# EAGLE design Negative_Ioniser (EAGLE 9.5.1)
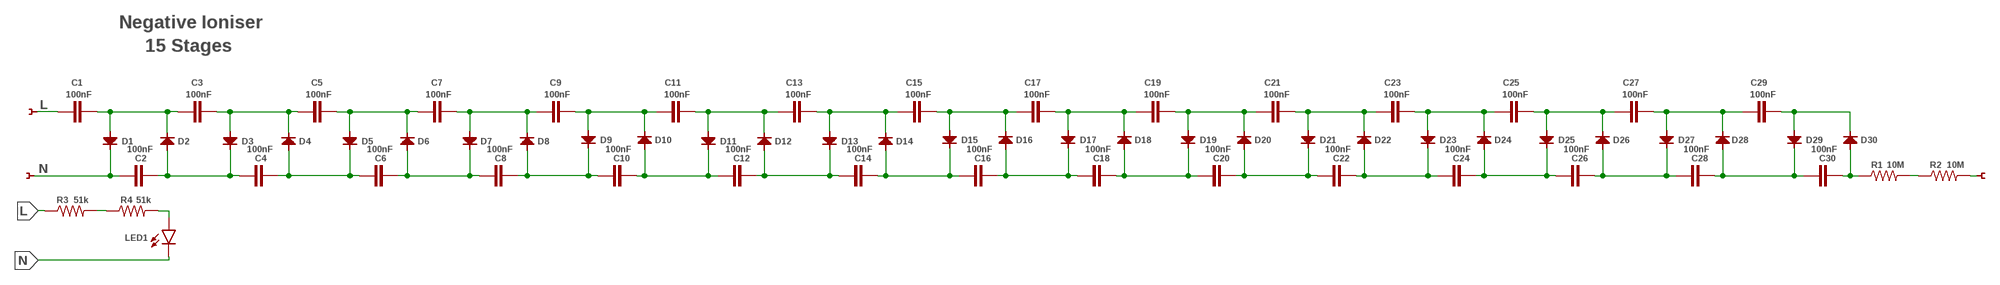
[diagram p0: schematic, sheet 1]

## Parts
C1  100nF  CAPACITOR-1812  [C1812]
C2  100nF  CAPACITOR-1812  [C1812]
C3  100nF  CAPACITOR-1812  [C1812]
C4  100nF  CAPACITOR-1812  [C1812]
C5  100nF  CAPACITOR-1812  [C1812]
C6  100nF  CAPACITOR-1812  [C1812]
C7  100nF  CAPACITOR-1812  [C1812]
C8  100nF  CAPACITOR-1812  [C1812]
C9  100nF  CAPACITOR-1812  [C1812]
C10  100nF  CAPACITOR-1812  [C1812]
C11  100nF  CAPACITOR-1812  [C1812]
C12  100nF  CAPACITOR-1812  [C1812]
C13  100nF  CAPACITOR-1812  [C1812]
C14  100nF  CAPACITOR-1812  [C1812]
C15  100nF  CAPACITOR-1812  [C1812]
C16  100nF  CAPACITOR-1812  [C1812]
C17  100nF  CAPACITOR-1812  [C1812]
C18  100nF  CAPACITOR-1812  [C1812]
C19  100nF  CAPACITOR-1812  [C1812]
C20  100nF  CAPACITOR-1812  [C1812]
C21  100nF  CAPACITOR-1812  [C1812]
C22  100nF  CAPACITOR-1812  [C1812]
C23  100nF  CAPACITOR-1812  [C1812]
C24  100nF  CAPACITOR-1812  [C1812]
C25  100nF  CAPACITOR-1812  [C1812]
C26  100nF  CAPACITOR-1812  [C1812]
C27  100nF  CAPACITOR-1812  [C1812]
C28  100nF  CAPACITOR-1812  [C1812]
C29  100nF  CAPACITOR-1812  [C1812]
C30  100nF  CAPACITOR-1812  [C1812]
D1  DIODE-1N4007  [DO-214A]
D2  DIODE-1N4007  [DO-214A]
D3  DIODE-1N4007  [DO-214A]
D4  DIODE-1N4007  [DO-214A]
D5  DIODE-1N4007  [DO-214A]
D6  DIODE-1N4007  [DO-214A]
D7  DIODE-1N4007  [DO-214A]
D8  DIODE-1N4007  [DO-214A]
D9  DIODE-1N4007  [DO-214A]
D10  DIODE-1N4007  [DO-214A]
D11  DIODE-1N4007  [DO-214A]
D12  DIODE-1N4007  [DO-214A]
D13  DIODE-1N4007  [DO-214A]
D14  DIODE-1N4007  [DO-214A]
D15  DIODE-1N4007  [DO-214A]
D16  DIODE-1N4007  [DO-214A]
D17  DIODE-1N4007  [DO-214A]
D18  DIODE-1N4007  [DO-214A]
D19  DIODE-1N4007  [DO-214A]
D20  DIODE-1N4007  [DO-214A]
D21  DIODE-1N4007  [DO-214A]
D22  DIODE-1N4007  [DO-214A]
D23  DIODE-1N4007  [DO-214A]
D24  DIODE-1N4007  [DO-214A]
D25  DIODE-1N4007  [DO-214A]
D26  DIODE-1N4007  [DO-214A]
D27  DIODE-1N4007  [DO-214A]
D28  DIODE-1N4007  [DO-214A]
D29  DIODE-1N4007  [DO-214A]
D30  DIODE-1N4007  [DO-214A]
LED1  LED-0603-SMD  [LED-0603]
R1  10M  RESISTOR-1206  [R1206]
R2  10M  RESISTOR-1206  [R1206]
R3  51k  RESISTOR-1210  [R1210]
R4  51k  RESISTOR-1210  [R1210]
TP1  TEST-POINT5MM  [SMD-SQ-PADS-5MM]
TP2  TEST-POINT5MM  [SMD-SQ-PADS-5MM]
TP3  TEST-POINT30X10  [LONG-RECT-PAD-50MM]

## Nets
L: C1.1 R3.1 TP1.P$1
N: C2.1 D1.CATHODE(C) LED1.C TP2.P$1
N$1: C2.2 C4.1 D2.ANODE(A) D3.CATHODE(C)
N$2: C1.2 C3.1 D1.ANODE(A) D2.CATHODE(C)
N$3: R3.2 R4.1
N$5: R1.2 R2.1
N$9: C5.2 C7.1 D5.ANODE(A) D6.CATHODE(C)
N$10: C4.2 C6.1 D4.ANODE(A) D5.CATHODE(C)
N$11: LED1.A R4.2
N$12: C6.2 C8.1 D6.ANODE(A) D7.CATHODE(C)
N$16: C3.2 C5.1 D3.ANODE(A) D4.CATHODE(C)
N$17: C9.2 C11.1 D9.ANODE(A) D10.CATHODE(C)
N$18: C8.2 C10.1 D8.ANODE(A) D9.CATHODE(C)
N$19: C10.2 C12.1 D10.ANODE(A) D11.CATHODE(C)
N$22: C7.2 C9.1 D7.ANODE(A) D8.CATHODE(C)
N$23: C13.2 C15.1 D13.ANODE(A) D14.CATHODE(C)
N$24: C12.2 C14.1 D12.ANODE(A) D13.CATHODE(C)
N$25: C14.2 C16.1 D14.ANODE(A) D15.CATHODE(C)
N$28: C11.2 C13.1 D11.ANODE(A) D12.CATHODE(C)
N$29: C17.2 C19.1 D17.ANODE(A) D18.CATHODE(C)
N$30: C16.2 C18.1 D16.ANODE(A) D17.CATHODE(C)
N$31: C18.2 C20.1 D18.ANODE(A) D19.CATHODE(C)
N$34: C15.2 C17.1 D15.ANODE(A) D16.CATHODE(C)
N$35: C21.2 C23.1 D21.ANODE(A) D22.CATHODE(C)
N$36: C20.2 C22.1 D20.ANODE(A) D21.CATHODE(C)
N$37: C22.2 C24.1 D22.ANODE(A) D23.CATHODE(C)
N$40: C19.2 C21.1 D19.ANODE(A) D20.CATHODE(C)
N$41: C25.2 C27.1 D25.ANODE(A) D26.CATHODE(C)
N$42: C24.2 C26.1 D24.ANODE(A) D25.CATHODE(C)
N$43: C26.2 C28.1 D26.ANODE(A) D27.CATHODE(C)
N$46: C23.2 C25.1 D23.ANODE(A) D24.CATHODE(C)
N$47: C27.2 C29.1 D27.ANODE(A) D28.CATHODE(C)
N$48: C28.2 C30.1 D28.ANODE(A) D29.CATHODE(C)
N$49: C29.2 D29.ANODE(A) D30.CATHODE(C)
N$50: C30.2 D30.ANODE(A) R1.1
OUTPUT: R2.2 TP3.1

## Notes on the sheet
- Negative Ioniser
- 15 Stages
- L
- N

## Library data of the parts
C1-C30 = Amaldev:CAPACITOR; PART-NUM: 1812B104K631CT; RATED: 630V; TOLERANCE: ±10%
D1-D30 = Amaldev:DIODE; I-RATING: 1A; PART-NUM: 1N4007G; V-RATING: 1kV
LED1 = Amaldev:LED; PART-NUM: D-060306R1/SS2/L
R1 R2 = Amaldev:RESISTOR; PART-NUM: 1206W4F1005T5E; RATED: 0.25W; TOLERANCE: ±1%
R3 R4 = Amaldev:RESISTOR; PART-NUM: CR1210J51K0P05Z; RATED: 0.5W; TOLERANCE: ±5%
TP1-TP3 = Amaldev:TEST-POINT

## Board
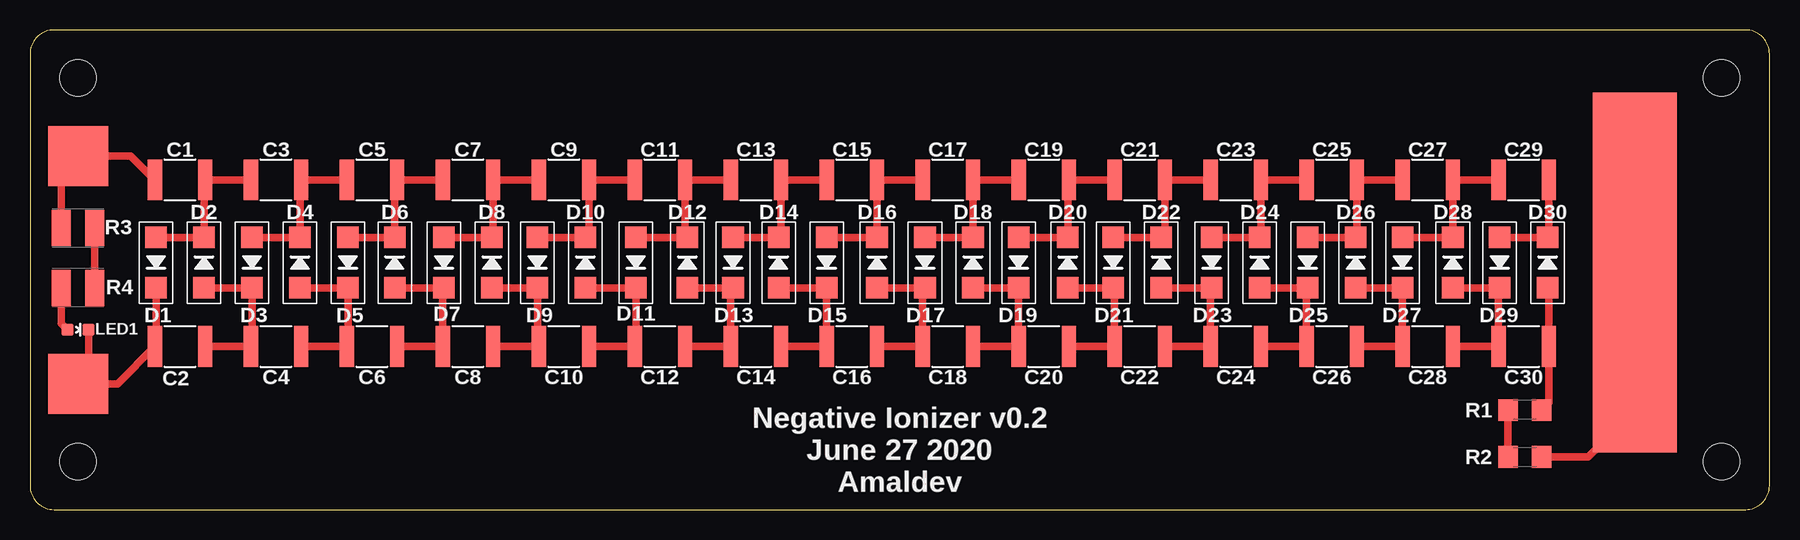
[diagram p1: board, top side]

Size 145 x 40 mm. Coordinates in mm from the lower left corner, seen from the top.
Outline: 2,0 143,0 arc90 145,2 145,38 arc90 143,40 2,40 arc90 0,38 0,2 arc90 2,0
Copper layers (1*16): Top 0.035mm / dielectric 1.5mm / Bottom 0.035mm
Design rules "PCB-Power-Design-Guidelines": minimum track width 6mil, minimum drill 10mil, track to track 6mil, track to pad 6mil, pad to pad 6mil, via to via 6mil, smd to smd 6mil, copper to edge 20mil, drill to drill 8mil, minimum pad ring 10mil, minimum via ring 8mil, stop-mask expansion 4mil, vias tented up to drill 0mil, thermal gap 10mil
Holes 3 mm at 4,4 4,36 141,36 141,4

### Footprints (pad centres in the part's own frame; a part is rotated, then mirrored left to right if it is on the bottom)
C1812 = smd 1.2 x 3.4: 1 -2.1,0; 2 2.1,0
DO-214A = smd 1.8 x 1.8: ANODE -2.1,0; CATHODE 2.1,0
LED-0603 = smd 1 x 1: A 0,-0.877; C 0,0.877
R1206 = smd 1.6 x 1.8: 1 -1.4,0; 2 1.4,0
R1210 = smd 1.6 x 3: 1 -1.4,0; 2 1.4,0
SMD-SQ-PADS-5MM = smd 5 x 5: P$1 0,0
LONG-RECT-PAD-50MM = smd 30 x 7: 1 0,0

### Placement (x,y rotation side)
C1  12.5,27.5 0 top
C2  12.5,13.6 0 top
C3  20.5,27.5 0 top
C4  20.5,13.6 0 top
C5  28.5,27.5 0 top
C6  28.5,13.6 0 top
C7  36.5,27.5 0 top
C8  36.5,13.6 0 top
C9  44.5,27.5 0 top
C10  44.5,13.6 0 top
C11  52.5,27.5 0 top
C12  52.5,13.6 0 top
C13  60.5,27.5 0 top
C14  60.5,13.6 0 top
C15  68.5,27.5 0 top
C16  68.5,13.6 0 top
C17  76.5,27.5 0 top
C18  76.5,13.6 0 top
C19  84.5,27.5 0 top
C20  84.5,13.6 0 top
C21  92.5,27.5 0 top
C22  92.5,13.6 0 top
C23  100.5,27.5 0 top
C24  100.5,13.6 0 top
C25  108.5,27.5 0 top
C26  108.5,13.6 0 top
C27  116.5,27.5 0 top
C28  116.5,13.6 0 top
C29  124.5,27.5 0 top
C30  124.5,13.6 0 top
D1  10.5,20.6 270 top
D2  14.5,20.6 90 top
D3  18.5,20.6 270 top
D4  22.5,20.6 90 top
D5  26.5,20.6 270 top
D6  30.4,20.6 90 top
D7  34.5,20.6 270 top
D8  38.5,20.6 90 top
D9  42.3,20.6 270 top
D10  46.3,20.6 90 top
D11  50.5,20.6 270 top
D12  54.8,20.6 90 top
D13  58.6,20.6 270 top
D14  62.4,20.6 90 top
D15  66.4,20.6 270 top
D16  70.6,20.6 90 top
D17  74.6,20.6 270 top
D18  78.6,20.6 90 top
D19  82.4,20.6 270 top
D20  86.5,20.6 90 top
D21  90.3,20.6 270 top
D22  94.3,20.6 90 top
D23  98.5,20.6 270 top
D24  102.5,20.6 90 top
D25  106.5,20.6 270 top
D26  110.5,20.6 90 top
D27  114.4,20.6 270 top
D28  118.6,20.6 90 top
D29  122.5,20.6 270 top
D30  126.5,20.6 90 top
LED1  4,15 270 top
R1  124.6,8.3 180 top
R2  124.6,4.4 0 top
R3  4,23.5 0 top
R4  4,18.5 180 top
TP1  4,29.5 0 top
TP2  4,10.5 0 top
TP3  133.79,19.79 90 top

### Tracks (layer width: path | path; a pad name or v marks a point on that pad's centre or on a via)
L
  Top 0.61: C1.1 8.4,29.5 TP1.P$1 4,28.5 2.6,27.1 R3.1
N
  Top 0.61: D1.CATHODE 10.5,14.7 10.4,14.6 C2.1 7.3,10.5 TP2.P$1 4.88,11.38 LED1.C
N$1
  Top 0.61: C2.2 C4.1 18.5,13.7 D3.CATHODE D2.ANODE
N$2
  Top 0.61: C3.1 C1.2 14.5,27.4 D2.CATHODE D1.ANODE
N$3
  Top 0.61: R4.1 R3.2
N$5
  Top 0.61: R1.2 R2.1
N$9
  Top 0.61: 30.8,27.5 C5.2 30.5,27.4 | 30.8,27.5 C7.1 | D5.ANODE D6.CATHODE 30.4,27.1 30.8,27.5
N$10
  Top 0.61: C4.2 C6.1 26.5,13.7 D5.CATHODE D4.ANODE
N$11
  Top 0.61: R4.2 2.6,15.52 LED1.A
N$12
  Top 0.61: C6.2 C8.1 34.4,18.4 D7.CATHODE D6.ANODE
N$16
  Top 0.61: C3.2 22.7,27.5 | 22.7,27.5 C5.1 | 22.7,27.5 22.5,27.3 22.6,27.2 22.6,26.2 22.5,26.1 D4.CATHODE D3.ANODE
N$17
  Top 0.61: C11.1 C9.2 46.6,23 D10.CATHODE D9.ANODE
N$18
  Top 0.61: 42.4,13.1 42.5,13 42.5,13.6 C8.2 | 42.4,13.1 C10.1 | D8.ANODE D9.CATHODE 42.3,13.2 42.4,13.1
N$19
  Top 0.61: C10.2 C12.1 50.5,13.7 D11.CATHODE D10.ANODE
N$22
  Top 0.61: C9.1 C7.2 | C7.2 38.5,27.4 | D7.ANODE D8.CATHODE 38.6,22.8 C7.2
N$23
  Top 0.61: C15.1 C13.2 62.6,22.9 D14.CATHODE D13.ANODE
N$24
  Top 0.61: C12.2 C14.1 58.4,18.3 D13.CATHODE D12.ANODE
N$25
  Top 0.61: C14.2 C16.1 D15.CATHODE D14.ANODE
N$28
  Top 0.61: C11.2 C13.1 | 54.5,27.4 C11.2 | D11.ANODE D12.CATHODE 54.6,22.9 C11.2
N$29
  Top 0.61: C19.1 C17.2 78.6,22.8 78.5,22.7 | 79.1,22.6 79,22.7 D18.CATHODE 78.5,22.7 | D17.ANODE 78.5,22.7
N$30
  Top 0.61: C16.2 C18.1 74.4,18.3 D17.CATHODE D16.ANODE
N$31
  Top 0.61: C18.2 C20.1 D19.CATHODE D18.ANODE
N$34
  Top 0.61: C17.1 C15.2 D16.CATHODE D15.ANODE
N$35
  Top 0.61: C23.1 C21.2 94.6,23 D22.CATHODE D21.ANODE
N$36
  Top 0.61: C20.2 C22.1 90.4,18.4 D21.CATHODE D20.ANODE
N$37
  Top 0.61: C22.2 C24.1 98.4,18.4 D23.CATHODE D22.ANODE
N$40
  Top 0.61: C21.1 C19.2 86.5,27.4 D20.CATHODE D19.ANODE
N$41
  Top 0.61: C27.1 C25.2 110.6,22.8 D26.CATHODE D25.ANODE
N$42
  Top 0.61: C24.2 C26.1 106.4,18.4 D25.CATHODE D24.ANODE
N$43
  Top 0.61: C26.2 C28.1 114.5,13.7 114.4,13.8 D27.CATHODE D26.ANODE
N$46
  Top 0.61: C25.1 C23.2 102.6,22.8 D24.CATHODE D23.ANODE
N$47
  Top 0.61: C29.1 C27.2 118.6,22.8 118.5,22.7 | D27.ANODE 118.5,22.7 | D28.CATHODE 118.5,22.7
N$48
  Top 0.61: 122.5,13.7 C30.1 | C30.1 C28.2 | D28.ANODE D29.CATHODE 122.4,18.4 C30.1
N$49
  Top 0.61: C29.2 126.6,22.8 D30.CATHODE D29.ANODE
N$50
  Top 0.61: R1.1 126.6,8.9 C30.2 126.6,18.4 D30.ANODE
OUTPUT
  Top 0.61: R2.2 129.9,4.4 132.85,7.35 133.79,8.29 | 134,8.3 133.8,8.3 133.79,8.29 | 133.79,31.41 TP3.1 133.79,8.29

### Text on the board
tPlace: Negative Ionizer v0.2 / June 27 2020 / Amaldev